# Altium schematic sheet CLK_src&sys_logic.SchDoc
size A2
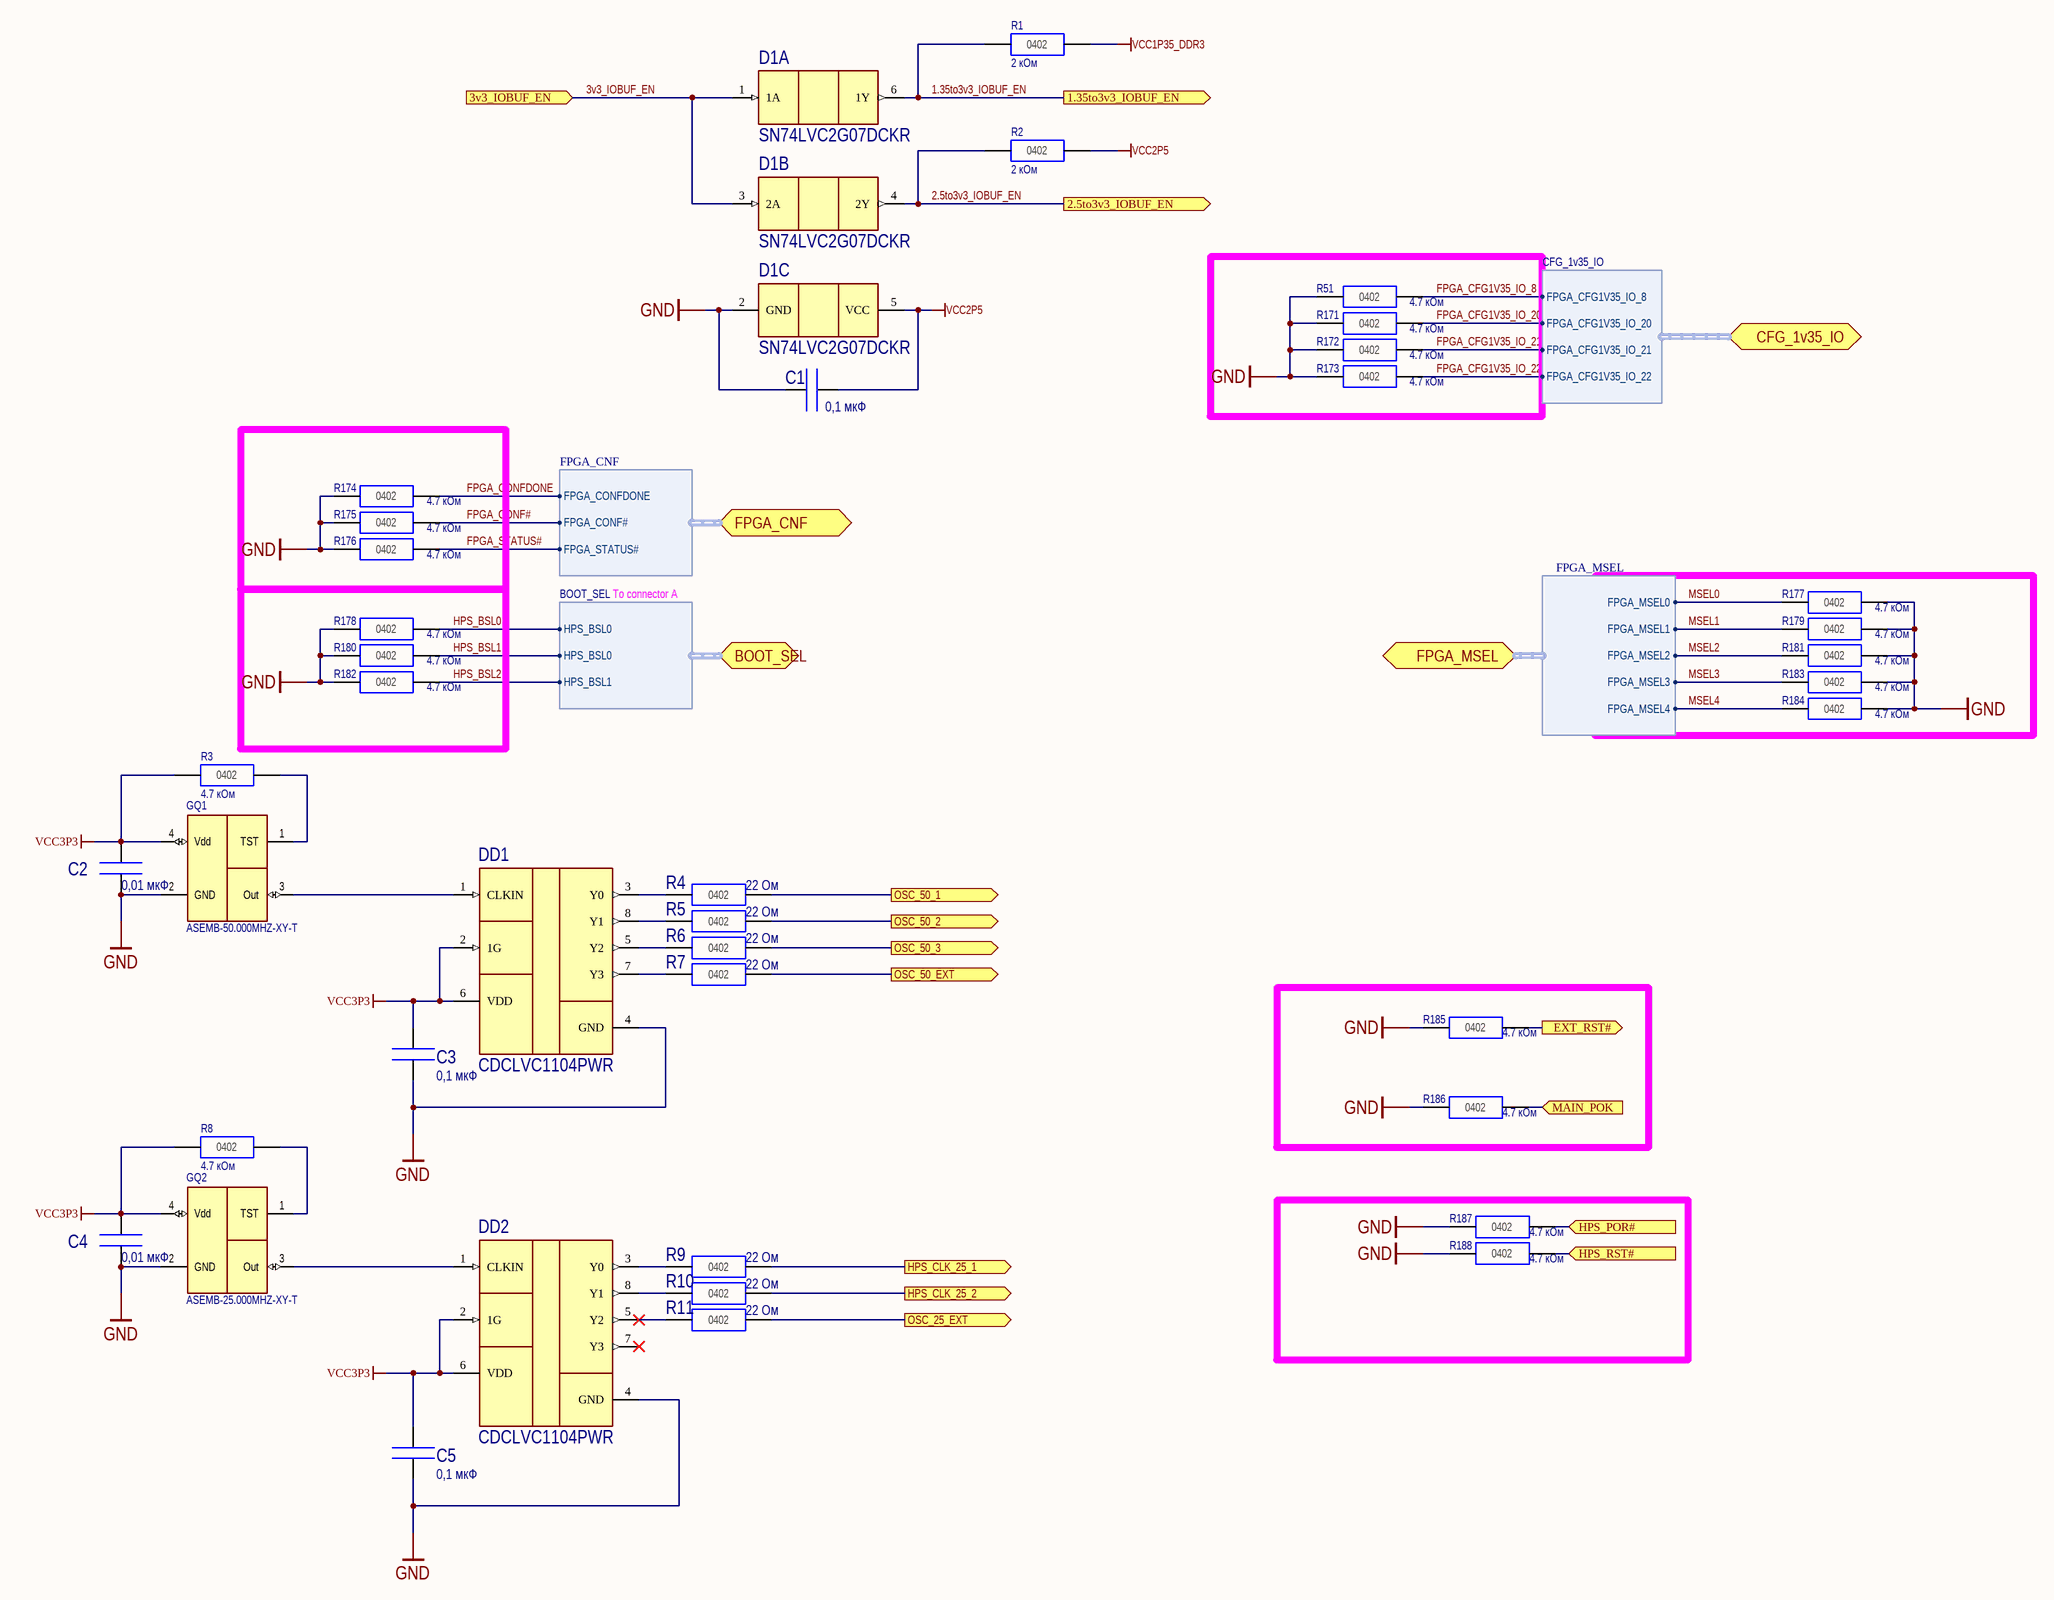
[diagram p0: CLK_src&sys_logic.SchDoc]

## Parts
C1  value 0,1 мкФ  [CC0402(1005)]  (hidden comment: CC0402-X7R-0,1 мкФ-20%-10В)
C2  value 0,01 мкФ  [CC0402(1005)]  (hidden comment: CC0402-X7R-0,01 мкФ-10%-50В)
C3  value 0,1 мкФ  [CC0402(1005)]  (hidden comment: CC0402-X7R-0,1 мкФ-20%-10В)
C4  value 0,01 мкФ  [CC0402(1005)]  (hidden comment: CC0402-X7R-0,01 мкФ-10%-50В)
C5  value 0,1 мкФ  [CC0402(1005)]  (hidden comment: CC0402-X7R-0,1 мкФ-20%-10В)
D1  SN74LVC2G07DCKR  [DCKR]  (parts A,B,C of 3)
DD1  CDCLVC1104PWR  [TSSOP-8]
DD2  CDCLVC1104PWR  [TSSOP-8]
GQ1  ASEMB-50.000MHZ-XY-T  [DFN210P320X100-4N]
GQ2  ASEMB-25.000MHZ-XY-T  [DFN210P320X100-4N]
R1  value 2 кОм  [CR0402(1005)]  (hidden comment: CR0402-2 кОм-±5%)
R2  value 2 кОм  [CR0402(1005)]  (hidden comment: CR0402-2 кОм-±5%)
R3  value 4.7 кОм  [CR0402(1005)]  (hidden comment: CR0402-4.7 кОм-±5%)
R4  value 22 Ом  [CR0402(1005)]  (hidden comment: CR0402-22 Ом-±5%)
R5  value 22 Ом  [CR0402(1005)]  (hidden comment: CR0402-22 Ом-±5%)
R6  value 22 Ом  [CR0402(1005)]  (hidden comment: CR0402-22 Ом-±5%)
R7  value 22 Ом  [CR0402(1005)]  (hidden comment: CR0402-22 Ом-±5%)
R8  value 4.7 кОм  [CR0402(1005)]  (hidden comment: CR0402-4.7 кОм-±5%)
R9  value 22 Ом  [CR0402(1005)]  (hidden comment: CR0402-22 Ом-±5%)
R10  value 22 Ом  [CR0402(1005)]  (hidden comment: CR0402-22 Ом-±5%)
R11  value 22 Ом  [CR0402(1005)]  (hidden comment: CR0402-22 Ом-±5%)
R51  value 4.7 кОм  [CR0402(1005)]  (hidden comment: CR0402-4.7 кОм-±5%)
R171  value 4.7 кОм  [CR0402(1005)]  (hidden comment: CR0402-4.7 кОм-±5%)
R172  value 4.7 кОм  [CR0402(1005)]  (hidden comment: CR0402-4.7 кОм-±5%)
R173  value 4.7 кОм  [CR0402(1005)]  (hidden comment: CR0402-4.7 кОм-±5%)
R174  value 4.7 кОм  [CR0402(1005)]  (hidden comment: CR0402-4.7 кОм-±5%)
R175  value 4.7 кОм  [CR0402(1005)]  (hidden comment: CR0402-4.7 кОм-±5%)
R176  value 4.7 кОм  [CR0402(1005)]  (hidden comment: CR0402-4.7 кОм-±5%)
R177  value 4.7 кОм  [CR0402(1005)]  (hidden comment: CR0402-4.7 кОм-±5%)
R178  value 4.7 кОм  [CR0402(1005)]  (hidden comment: CR0402-4.7 кОм-±5%)
R179  value 4.7 кОм  [CR0402(1005)]  (hidden comment: CR0402-4.7 кОм-±5%)
R180  value 4.7 кОм  [CR0402(1005)]  (hidden comment: CR0402-4.7 кОм-±5%)
R181  value 4.7 кОм  [CR0402(1005)]  (hidden comment: CR0402-4.7 кОм-±5%)
R182  value 4.7 кОм  [CR0402(1005)]  (hidden comment: CR0402-4.7 кОм-±5%)
R183  value 4.7 кОм  [CR0402(1005)]  (hidden comment: CR0402-4.7 кОм-±5%)
R184  value 4.7 кОм  [CR0402(1005)]  (hidden comment: CR0402-4.7 кОм-±5%)
R185  value 4.7 кОм  [CR0402(1005)]  (hidden comment: CR0402-4.7 кОм-±5%)
R186  value 4.7 кОм  [CR0402(1005)]  (hidden comment: CR0402-4.7 кОм-±5%)
R187  value 4.7 кОм  [CR0402(1005)]  (hidden comment: CR0402-4.7 кОм-±5%)
R188  value 4.7 кОм  [CR0402(1005)]  (hidden comment: CR0402-4.7 кОм-±5%)

## Ports
1.35to3v3_IOBUF_EN (out), 2.5to3v3_IOBUF_EN (out), 3v3_IOBUF_EN (in), BOOT_SEL (harness BOOT_SEL), CFG_1v35_IO (harness CFG_1v35_IO), EXT_RST# (out), FPGA_CNF (harness FPGA_CNF), FPGA_MSEL (harness FPGA_MSEL), HPS_CLK_25_1 (out), HPS_CLK_25_2 (out), HPS_POR# (in), HPS_RST# (in), MAIN_POK (in), OSC_25_EXT (out), OSC_50_1 (out), OSC_50_2 (out), OSC_50_3 (out), OSC_50_EXT (out)

## Harnesses
FPGA_MSEL: FPGA_MSEL0, FPGA_MSEL1, FPGA_MSEL2, FPGA_MSEL3, FPGA_MSEL4
FPGA_CNF: FPGA_STATUS#, FPGA_CONF#, FPGA_CONFDONE
BOOT_SEL: HPS_BSL0, HPS_BSL0, HPS_BSL1
CFG_1v35_IO: FPGA_CFG1V35_IO_8, FPGA_CFG1V35_IO_20, FPGA_CFG1V35_IO_21, FPGA_CFG1V35_IO_22

## Nets
GND: C1.1(+) C2.1(+) C3.2(-) C4.1(+) C5.2(-) D1.2(GND) DD1.4(GND) DD2.4(GND) GQ1.2(GND) GQ2.2(GND) R51.1(+) R171.1(+) R172.1(+) R173.1(+) R174.1(+) R175.1(+) R176.1(+) R177.2(-) R178.1(+) R179.2(-) R180.1(+) R181.2(-) R182.1(+) R183.2(-) R184.2(-) R185.1(+) R186.1(+) R187.1(+) R188.1(+)
VCC1P35_DDR3: R1.2(-)
VCC2P5: C1.2(-) D1.5(VCC) R2.2(-)
VCC3P3: C2.2(-) C3.1(+) C4.2(-) C5.1(+) DD1.2(1G) DD1.6(VDD) DD2.2(1G) DD2.6(VDD) GQ1.4(Vdd) GQ2.4(Vdd) R3.1(+) R8.1(+)
1.35to3v3_IOBUF_EN: D1.6(1Y) R1.1(+) ; port 1.35to3v3_IOBUF_EN
2.5to3v3_IOBUF_EN: D1.4(2Y) R2.1(+) ; port 2.5to3v3_IOBUF_EN
3v3_IOBUF_EN: D1.1(1A) D1.3(2A) ; port 3v3_IOBUF_EN
EXT_RST#: R185.2(-) ; port EXT_RST#
FPGA_CFG1V35_IO_8: R51.2(-) ; port CFG_1v35_IO.FPGA_CFG1V35_IO_8
FPGA_CFG1V35_IO_20: R171.2(-) ; port CFG_1v35_IO.FPGA_CFG1V35_IO_20
FPGA_CFG1V35_IO_21: R172.2(-) ; port CFG_1v35_IO.FPGA_CFG1V35_IO_21
FPGA_CFG1V35_IO_22: R173.2(-) ; port CFG_1v35_IO.FPGA_CFG1V35_IO_22
FPGA_CONF#: R175.2(-) ; port FPGA_CNF.FPGA_CONF#
FPGA_CONFDONE: R174.2(-) ; port FPGA_CNF.FPGA_CONFDONE
FPGA_STATUS#: R176.2(-) ; port FPGA_CNF.FPGA_STATUS#
HPS_BSL0: R178.2(-) R180.2(-) ; port BOOT_SEL.HPS_BSL0  [also labelled HPS_BSL1]
HPS_BSL2: R182.2(-) ; port BOOT_SEL.HPS_BSL1
HPS_CLK_25_1: R9.2(-) ; port HPS_CLK_25_1
HPS_CLK_25_2: R10.2(-) ; port HPS_CLK_25_2
HPS_POR#: R187.2(-) ; port HPS_POR#
HPS_RST#: R188.2(-) ; port HPS_RST#
MAIN_POK: R186.2(-) ; port MAIN_POK
MSEL0: R177.1(+) ; port FPGA_MSEL.FPGA_MSEL0
MSEL1: R179.1(+) ; port FPGA_MSEL.FPGA_MSEL1
MSEL2: R181.1(+) ; port FPGA_MSEL.FPGA_MSEL2
MSEL3: R183.1(+) ; port FPGA_MSEL.FPGA_MSEL3
MSEL4: R184.1(+) ; port FPGA_MSEL.FPGA_MSEL4
OSC_25_EXT: R11.2(-) ; port OSC_25_EXT
OSC_50_1: R4.2(-) ; port OSC_50_1
OSC_50_2: R5.2(-) ; port OSC_50_2
OSC_50_3: R6.2(-) ; port OSC_50_3
OSC_50_EXT: R7.2(-) ; port OSC_50_EXT
NetDD1_1: DD1.1(CLKIN) GQ1.3(Out)
NetDD1_3: DD1.3(Y0) R4.1(+)
NetDD1_5: DD1.5(Y2) R6.1(+)
NetDD1_7: DD1.7(Y3) R7.1(+)
NetDD1_8: DD1.8(Y1) R5.1(+)
NetDD2_1: DD2.1(CLKIN) GQ2.3(Out)
NetDD2_3: DD2.3(Y0) R9.1(+)
NetDD2_5: DD2.5(Y2) R11.1(+)
NetDD2_8: DD2.8(Y1) R10.1(+)
NetGQ1_1: GQ1.1(TST) R3.2(-)
NetGQ2_1: GQ2.1(TST) R8.2(-)

Not connected (* = marked no-connect by the designer): DD2 7(Y3)*

## Notes on the sheet
- To connector A
- (in symbol CR0402-#-±5%) 0402

## Library data of the parts
C1-C5 = CC0402-X7R-#-20%-10В: Чип конденсатор керамический; Supplier 1: Digi-Key
  C1 C3 C5: Supplier Part Number 1: 399-3520-1-ND
  C2 C4: Supplier Part Number 1: 490-4516-2-ND
D1 = SN74LVC2G06: Supplier 1: Digi-Key; Supplier Part Number 1: 296-13493-2-ND
DD1 DD2 = CDCLVC1104PWR: High-Performance  Clock Buffer 1:4; Supplier 1: Digi-Key; Supplier Part Number 1: 296-27549-1-ND
GQ1 GQ2 = OSC-ABRCN-ASE3: Dual High Side Switch With OC_DET 500mA/CH; Manufacturer Name: Abracon LLC
  GQ1: Manufacturer Part No.: ASEMB-50.000MHZ-XY-T
  GQ2: Manufacturer Part No.: ASEMB-25.000MHZ-XY-T
R1-R11 R51 R171-R188 = CR0402-#-±5%: Чип резистор; Maximum Working Voltage: 50 В; TOLERANCE: 5%; Supplier 1: Digi-Key
  R1 R2: Supplier Part Number 1: 311-2.0KJRTR-ND
  R3 R8 R51 R171-R188: Supplier Part Number 1: 311-4.7KJRTR-ND
  R4-R7 R9-R11: Supplier Part Number 1: 311-10.0KLRDKR-ND